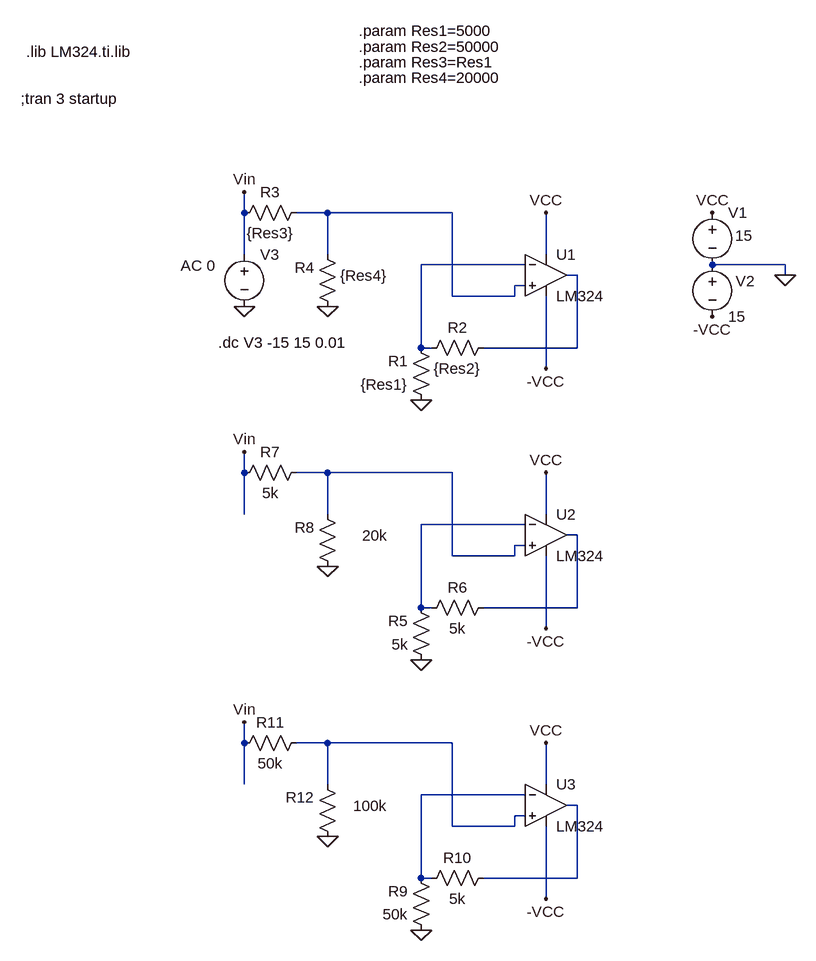
[diagram p0: schematic simulacion_b_ds.asc]
simulacion_b_ds.asc, the LTspice schematic file:
Version 4
SHEET 1 880 1192
WIRE -208 32 -208 0
WIRE -80 32 -128 32
WIRE 112 32 -80 32
WIRE -208 96 -208 32
WIRE -80 96 -80 32
WIRE 256 96 256 32
WIRE 224 112 64 112
WIRE 624 112 512 112
WIRE 304 128 288 128
WIRE 624 128 624 112
WIRE 224 144 208 144
WIRE 112 160 112 32
WIRE 208 160 208 144
WIRE 208 160 112 160
WIRE 64 240 64 112
WIRE 80 240 64 240
WIRE 304 240 304 128
WIRE 304 240 160 240
WIRE 256 272 256 160
WIRE -208 432 -208 400
WIRE -80 432 -128 432
WIRE 112 432 -80 432
WIRE -208 496 -208 432
WIRE -80 496 -80 432
WIRE 256 496 256 432
WIRE 224 512 64 512
WIRE 304 528 288 528
WIRE 224 544 208 544
WIRE 112 560 112 432
WIRE 208 560 208 544
WIRE 208 560 112 560
WIRE 64 640 64 512
WIRE 80 640 64 640
WIRE 304 640 304 528
WIRE 304 640 160 640
WIRE 256 672 256 560
WIRE -208 848 -208 816
WIRE -80 848 -128 848
WIRE 112 848 -80 848
WIRE -208 912 -208 848
WIRE -80 912 -80 848
WIRE 256 912 256 848
WIRE 224 928 64 928
WIRE 304 944 288 944
WIRE 224 960 208 960
WIRE 112 976 112 848
WIRE 208 976 208 960
WIRE 208 976 112 976
WIRE 64 1056 64 928
WIRE 80 1056 64 1056
WIRE 304 1056 304 944
WIRE 304 1056 160 1056
WIRE 256 1088 256 976
FLAG 624 128 0
FLAG 512 32 VCC
FLAG 256 32 VCC
FLAG 256 272 -VCC
FLAG 512 192 -VCC
FLAG -208 176 0
FLAG -208 0 Vin
FLAG 64 320 0
FLAG -80 176 0
FLAG 256 432 VCC
FLAG 256 672 -VCC
FLAG -208 400 Vin
FLAG 64 720 0
FLAG -80 576 0
FLAG 256 848 VCC
FLAG 256 1088 -VCC
FLAG -208 816 Vin
FLAG 64 1136 0
FLAG -80 992 0
SYMBOL Opamps\\opamp2 256 64 R0
SYMATTR InstName U1
SYMATTR Value LM324
SYMBOL voltage 512 16 R0
WINDOW 3 35 51 Left 2
WINDOW 123 0 0 Left 2
WINDOW 39 0 0 Left 2
SYMATTR Value 15
SYMATTR InstName V1
SYMBOL voltage 512 96 R0
WINDOW 0 36 41 Left 2
WINDOW 123 0 0 Left 2
WINDOW 39 0 0 Left 2
SYMATTR InstName V2
SYMATTR Value 15
SYMBOL voltage -208 80 R0
WINDOW 123 -98 33 Left 2
WINDOW 39 0 0 Left 2
SYMATTR Value2 AC 0
SYMATTR Value ""
SYMATTR InstName V3
SYMBOL res 80 336 R180
WINDOW 0 36 76 Left 2
WINDOW 3 36 40 Left 2
SYMATTR InstName R1
SYMATTR Value {Res1}
SYMBOL res 176 224 R90
WINDOW 0 0 56 VBottom 2
WINDOW 3 32 56 VTop 2
SYMATTR InstName R2
SYMATTR Value {Res2}
SYMBOL res -224 48 R270
WINDOW 0 32 56 VTop 2
WINDOW 3 0 56 VBottom 2
SYMATTR InstName R3
SYMATTR Value {Res3}
SYMBOL res -64 192 R180
WINDOW 0 36 76 Left 2
WINDOW 3 -76 63 Left 2
SYMATTR InstName R4
SYMATTR Value {Res4}
SYMBOL Opamps\\opamp2 256 464 R0
SYMATTR InstName U2
SYMATTR Value LM324
SYMBOL res 80 736 R180
WINDOW 0 36 76 Left 2
WINDOW 3 36 40 Left 2
SYMATTR InstName R5
SYMATTR Value 5k
SYMBOL res 176 624 R90
WINDOW 0 0 56 VBottom 2
WINDOW 3 32 56 VTop 2
SYMATTR InstName R6
SYMATTR Value 5k
SYMBOL res -224 448 R270
WINDOW 0 32 56 VTop 2
WINDOW 3 0 56 VBottom 2
SYMATTR InstName R7
SYMATTR Value 5k
SYMBOL res -64 592 R180
WINDOW 0 36 76 Left 2
WINDOW 3 -76 63 Left 2
SYMATTR InstName R8
SYMATTR Value 20k
SYMBOL Opamps\\opamp2 256 880 R0
SYMATTR InstName U3
SYMATTR Value LM324
SYMBOL res 80 1152 R180
WINDOW 0 36 76 Left 2
WINDOW 3 36 40 Left 2
SYMATTR InstName R9
SYMATTR Value 50k
SYMBOL res 176 1040 R90
WINDOW 0 0 56 VBottom 2
WINDOW 3 32 56 VTop 2
SYMATTR InstName R10
SYMATTR Value 5k
SYMBOL res -224 864 R270
WINDOW 0 32 56 VTop 2
WINDOW 3 0 56 VBottom 2
SYMATTR InstName R11
SYMATTR Value 50k
SYMBOL res -64 1008 R180
WINDOW 0 36 76 Left 2
WINDOW 3 -76 63 Left 2
SYMATTR InstName R12
SYMATTR Value 100k
TEXT -552 -144 Left 2 !;tran 3 startup
TEXT -544 -216 Left 2 !.lib LM324.ti.lib
TEXT -32 -248 Left 2 !.param Res1=5000
TEXT -32 -224 Left 2 !.param Res2=50000
TEXT -32 -200 Left 2 !.param Res3=Res1
TEXT -32 -176 Left 2 !.param Res4=20000
TEXT -248 232 Left 2 !.dc V3 -15 15 0.01

The netlist it stands for:
* simulacion_b_ds.asc
XU1 N001 N002 VCC -VCC N003 LM324  ; pins In+ In- V+ V- OUT
V1 VCC 0 15
V2 0 -VCC 15
V3 Vin 0 AC 0
R1 0 N002 {Res1}
R2 N003 N002 {Res2}
R3 Vin N001 {Res3}
R4 0 N001 {Res4}
XU2 N004 N005 VCC -VCC N006 LM324  ; pins In+ In- V+ V- OUT
R5 0 N005 5k
R6 N006 N005 5k
R7 Vin N004 5k
R8 0 N004 20k
XU3 N007 N008 VCC -VCC N009 LM324  ; pins In+ In- V+ V- OUT
R9 0 N008 50k
R10 N009 N008 5k
R11 Vin N007 50k
R12 0 N007 100k
;tran 3 startup
.lib LM324.ti.lib
.param Res1=5000
.param Res2=50000
.param Res3=Res1
.param Res4=20000
.dc V3 -15 15 0.01
.backanno
.end